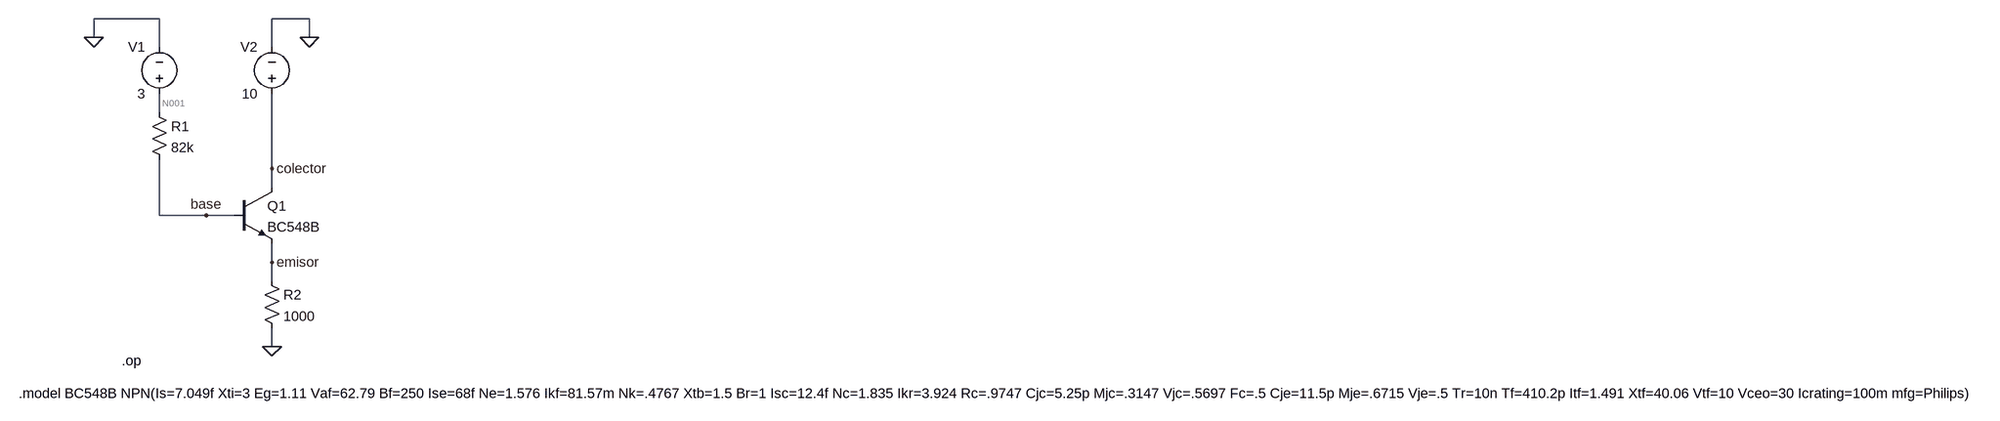
[diagram p0: schematic DiseñoCircuitoTL2Polarizacion.asc]
DiseñoCircuitoTL2Polarizacion.asc, the LTspice schematic file:
Version 4
SHEET 1 3552 680
WIRE 48 -112 -64 -112
WIRE 304 -112 240 -112
WIRE -64 -80 -64 -112
WIRE 304 -80 304 -112
WIRE 48 -64 48 -112
WIRE 240 -64 240 -112
WIRE 48 48 48 16
WIRE 240 144 240 16
WIRE 240 176 240 144
WIRE 48 224 48 128
WIRE 128 224 48 224
WIRE 176 224 128 224
WIRE 240 304 240 272
WIRE 240 336 240 304
WIRE 240 448 240 416
FLAG 240 448 0
FLAG 304 -80 0
FLAG 128 224 base
FLAG 240 304 emisor
FLAG 240 144 colector
FLAG -64 -80 0
SYMBOL res 32 32 R0
SYMATTR InstName R1
SYMATTR Value 82k
SYMBOL npn 176 176 R0
SYMATTR InstName Q1
SYMATTR Value BC548B
SYMBOL res 224 320 R0
SYMATTR InstName R2
SYMATTR Value 1000
SYMBOL voltage 240 32 R180
WINDOW 0 24 96 Left 2
WINDOW 3 24 16 Left 2
WINDOW 123 0 0 Left 0
WINDOW 39 0 0 Left 0
SYMATTR InstName V2
SYMATTR Value 10
SYMBOL voltage 48 32 R180
WINDOW 0 24 96 Left 2
WINDOW 3 24 16 Left 2
SYMATTR InstName V1
SYMATTR Value 3
TEXT -16 472 Left 2 !.op
TEXT -192 528 Left 2 !.model BC548B NPN(Is=7.049f Xti=3 Eg=1.11 Vaf=62.79 Bf=250 Ise=68f Ne=1.576 Ikf=81.57m Nk=.4767 Xtb=1.5 Br=1 Isc=12.4f Nc=1.835 Ikr=3.924 Rc=.9747 Cjc=5.25p Mjc=.3147 Vjc=.5697 Fc=.5 Cje=11.5p Mje=.6715 Vje=.5 Tr=10n Tf=410.2p Itf=1.491 Xtf=40.06 Vtf=10 Vceo=30 Icrating=100m mfg=Philips)

The netlist it stands for:
* DiseñoCircuitoTL2Polarizacion.asc
R1 N001 base 82k
Q1 colector base emisor 0 BC548B
R2 emisor 0 1000
V2 colector 0 10
V1 N001 0 3
.model NPN NPN
.model PNP PNP
.lib standard.bjt
.op
.model BC548B NPN(Is=7.049f Xti=3 Eg=1.11 Vaf=62.79 Bf=250 Ise=68f Ne=1.576 Ikf=81.57m Nk=.4767 Xtb=1.5 Br=1 Isc=12.4f Nc=1.835 Ikr=3.924 Rc=.9747 Cjc=5.25p Mjc=.3147 Vjc=.5697 Fc=.5 Cje=11.5p Mje=.6715 Vje=.5 Tr=10n Tf=410.2p Itf=1.491 Xtf=40.06 Vtf=10 Vceo=30 Icrating=100m mfg=Philips)
.backanno
.end

* Results of the author's LTspice run, read from the files saved beside the schematic
* Operating Point:
*   V(n001) = 3 V
*   V(base) = 2.4 V
*   V(colector) = 10 V
*   V(emisor) = 1.725 V
*   Ic(Q1) = 1.717 mA
*   Ib(Q1) = 7.312 µA
*   Ie(Q1) = -1.725 mA
*   I(R2) = 1.725 mA
*   I(R1) = 7.312 µA
*   I(V1) = -7.312 µA
*   I(V2) = -1.717 mA
* From the log:
*   Semiconductor Device Operating Points:
*                           --- Bipolar Transistors ---
*   Name:       q1
*   Model:    bc548b
*   Ib:       7.31e-06
*   Ic:       1.72e-03
*   Vbe:      6.76e-01
*   Vbc:     -7.60e+00
*   Vce:      8.28e+00
*   BetaDC:   2.35e+02
*   Gm:       6.52e-02
*   Rpi:      3.74e+03
*   Rx:       0.00e+00
*   Ro:       4.10e+04
*   Cbe:      6.60e-11
*   Cbc:      2.27e-12
*   Cjs:      0.00e+00
*   BetaAC:   2.44e+02
*   Cbx:      0.00e+00
*   Ft:       1.52e+08